# Altium schematic sheet STM32G0B1CEU6.SchDoc
size A3; Revision: 10
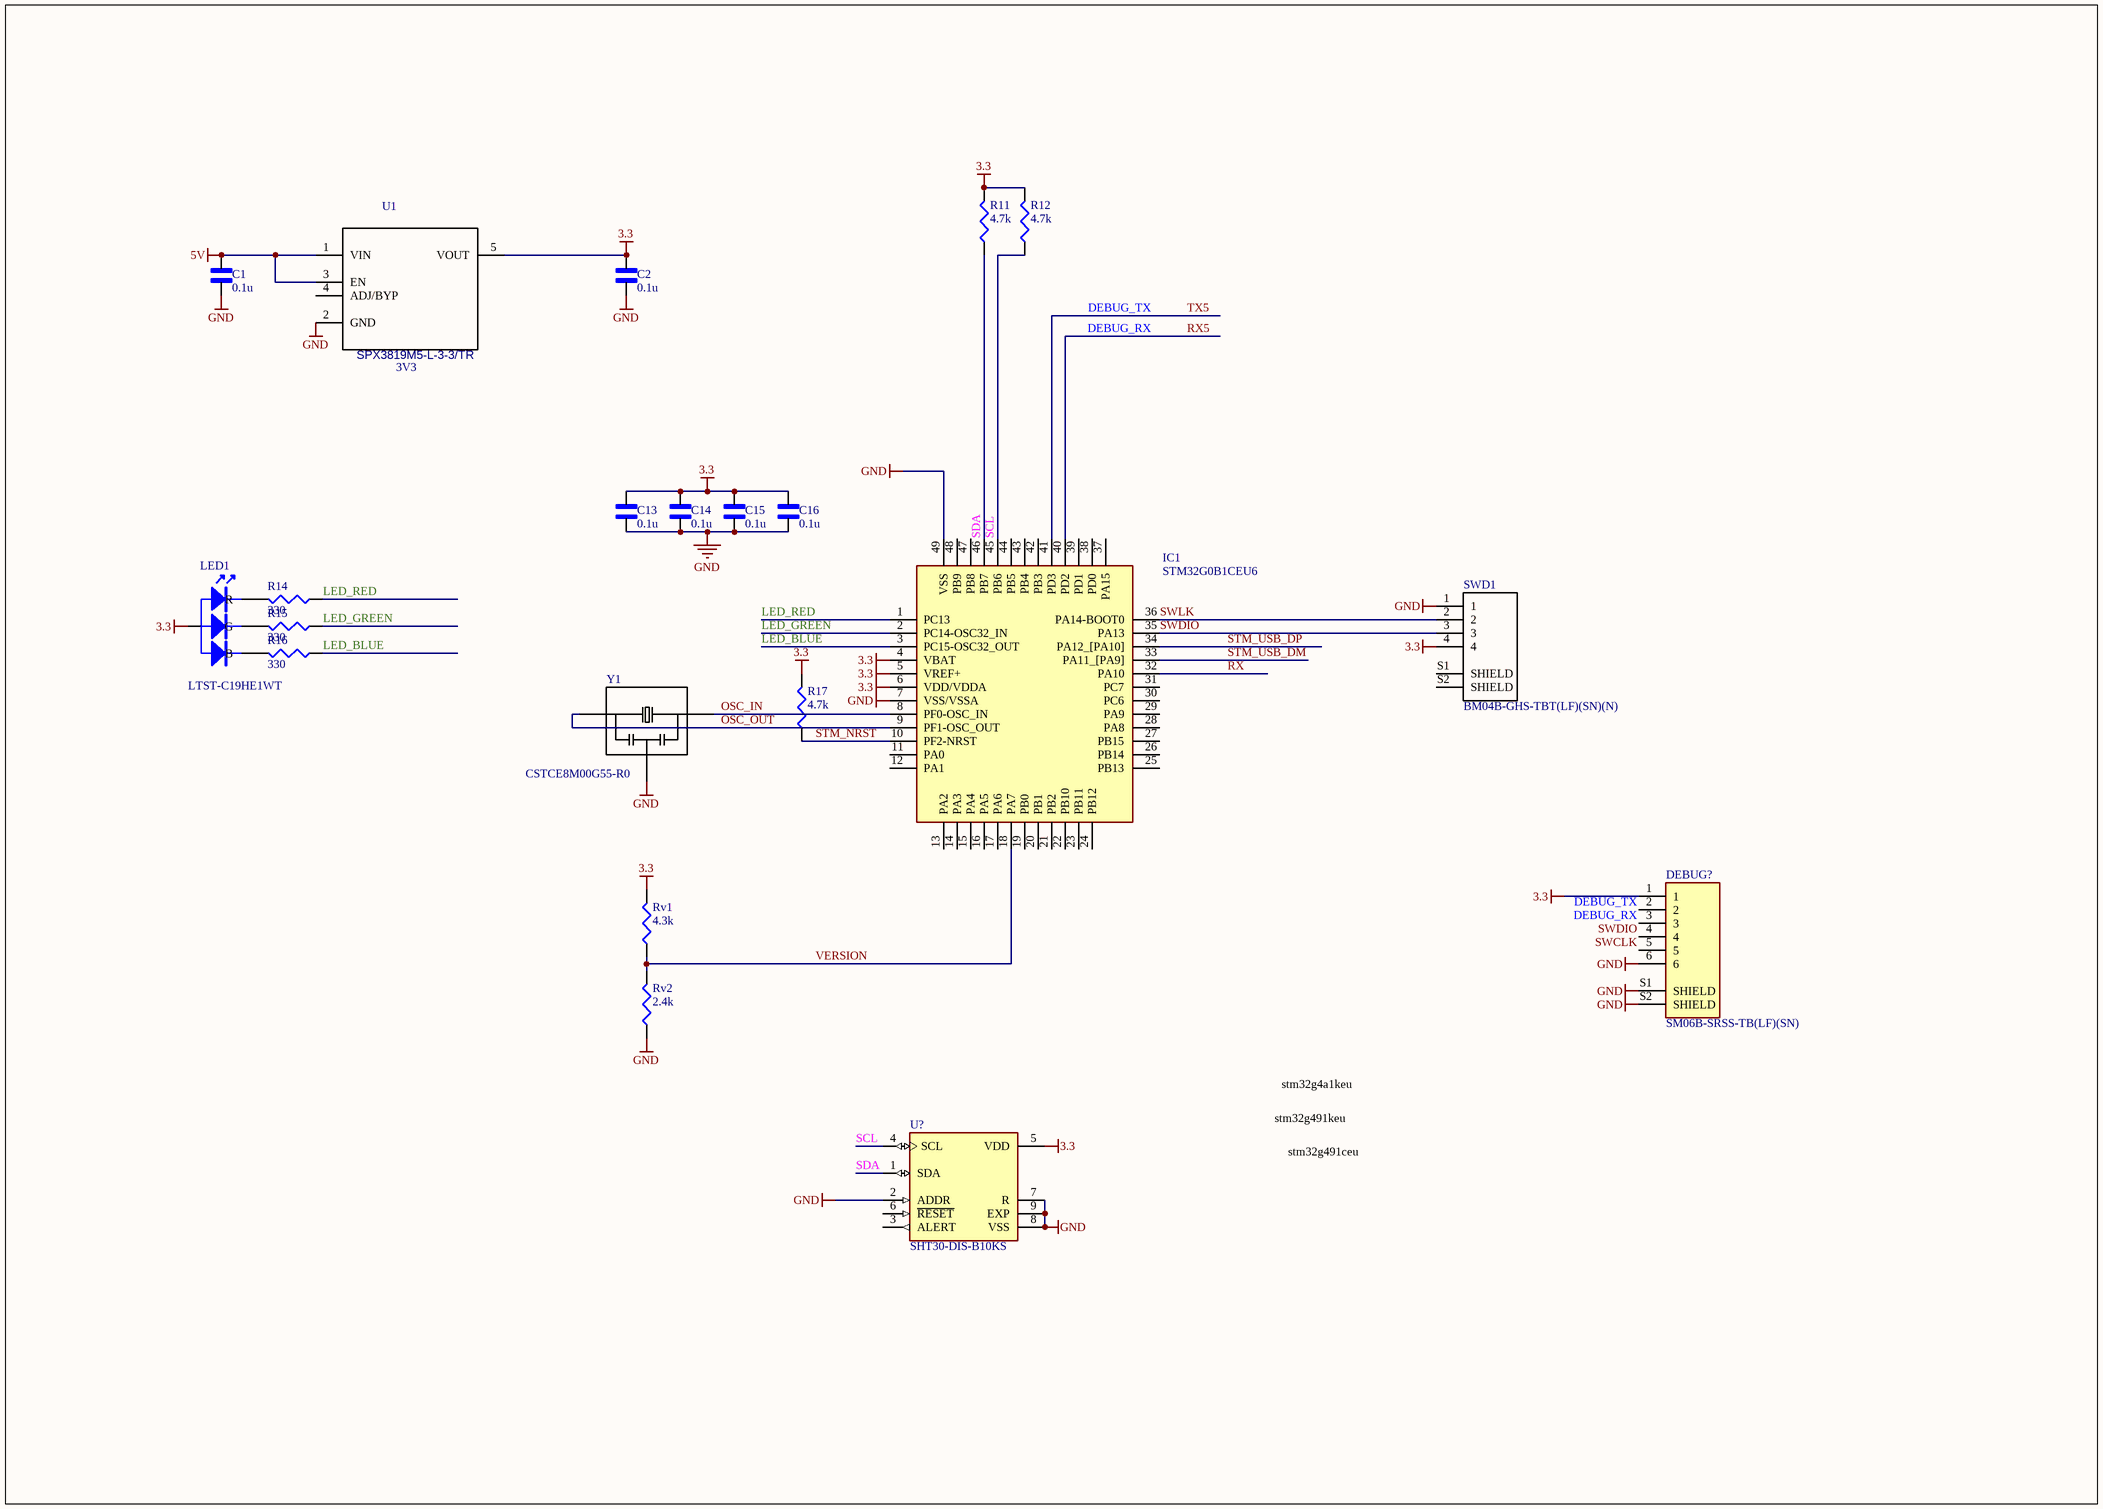
[diagram p0: STM32G0B1CEU6.SchDoc]

## Parts
C1  value 0.1u  [CAPC1005X55N]  (hidden comment: GCM155R71H104KE02D)
C2  value 0.1u  [CAPC1005X55N]  (hidden comment: GCM155R71H104KE02D)
C13  value 0.1u  [CAPC1005X55N]  (hidden comment: GCM155R71H104KE02D)
C14  value 0.1u  [CAPC1005X55N]  (hidden comment: GCM155R71H104KE02D)
C15  value 0.1u  [CAPC1005X55N]  (hidden comment: GCM155R71H104KE02D)
C16  value 0.1u  [CAPC1005X55N]  (hidden comment: GCM155R71H104KE02D)
DEBUG?  SM06B-SRSS-TB(LF)(SN)  [JST_SM06B-SRSS-TB(LF)(SN)]
IC1  STM32G0B1CEU6  [QFN50P700X700X60-49N-D]
LED1  LTST-C19HE1WT  [LTST-C19HE1WT]
R11  value 4.7k  [RESC1005X40N]  (hidden comment: RC0402FR-074K7L)
R12  value 4.7k  [RESC1005X40N]  (hidden comment: RC0402FR-074K7L)
R14  value 330  [RESC1005X40N]  (hidden comment: RC0402FR-07330RL)
R15  value 330  [RESC1005X40N]  (hidden comment: RC0402FR-07330RL)
R16  value 330  [RESC1005X40N]  (hidden comment: RC0402FR-07330RL)
R17  value 4.7k  [RESC1005X40N]  (hidden comment: RC0402FR-074K7L)
Rv1  value 4.3k  [RESC1005X40N]  (hidden comment: RC0402FR-074K3L)
Rv2  value 2.4k  [RESC1005X40N]  (hidden comment: RC0402FR-072K4L)
SWD1  BM04B-GHS-TBT(LF)(SN)(N)  [JST_BM04B-GHS-holes]
U1  value 3V3  [*SOT95P280X145-5N]  (hidden comment: SPX3819M5-L-3-3/TR)
U?  SHT30-DIS-B10KS  [XDCR_SHT30-DIS-B10KS]
Y1  CSTCE8M00G55-R0  [*OSC_CSTCE8M00G55-R0]

## Nets
3.3: C2.2 C13.2 C14.2 C15.2 C16.2 DEBUG?.1 IC1.4(VBAT) IC1.5(VREF+) IC1.6(VDD/VDDA) LED1.4(A) R11.2 R12.2 R17.2 Rv1.2 SWD1.4 U1.5(VOUT) U?.5(VDD)
5V: C1.2 U1.1(VIN) U1.3(EN)
GND: C1.1 C2.1 C13.1 C14.1 C15.1 C16.1 DEBUG?.6 DEBUG?.S1(SHIELD) DEBUG?.S2(SHIELD) IC1.7(VSS/VSSA) IC1.49(VSS) Rv2.1 SWD1.1 U1.2(GND) U?.2(ADDR) U?.7(R) U?.8(VSS) U?.9(EXP) Y1.2
DEBUG_RX: DEBUG?.3 IC1.40(PD2)  [also labelled RX5]
DEBUG_TX: DEBUG?.2 IC1.41(PD3)  [also labelled TX5]
LED_BLUE: IC1.3(PC15-OSC32_OUT) R16.1
LED_GREEN: IC1.2(PC14-OSC32_IN) R15.1
LED_RED: IC1.1(PC13) R14.1
OSC_IN: IC1.8(PF0-OSC_IN) Y1.3
OSC_OUT: IC1.9(PF1-OSC_OUT) Y1.1
RX: IC1.32(PA10)
SCL: IC1.45(PB6) R12.1 U?.4(SCL)
SDA: IC1.46(PB7) R11.1 U?.1(SDA)
STM_NRST: IC1.10(PF2-NRST) R17.1
STM_USB_DM: IC1.33(PA11_[PA9])
STM_USB_DP: IC1.34(PA12_[PA10])
SWCLK: DEBUG?.5
SWDIO: DEBUG?.4 IC1.35(PA13) SWD1.3
SWLK: IC1.36(PA14-BOOT0) SWD1.2
VERSION: IC1.18(PA7) Rv1.1 Rv2.2
NetLED1_1: LED1.1(R) R14.2
NetLED1_2: LED1.2(G) R15.2
NetLED1_3: LED1.3(B) R16.2

Not connected (* = marked no-connect by the designer): IC1 11(PA0) 12(PA1) 13(PA2) 14(PA3) 15(PA4) 16(PA5) 17(PA6) 19(PB0) 20(PB1) 21(PB2) 22(PB10) 23(PB11) 24(PB12) 25(PB13) 26(PB14) 27(PB15) 28(PA8) 29(PA9) 30(PC6) 31(PC7) 37(PA15) 38(PD0) 39(PD1) 42(PB3) 43(PB4) 44(PB5) 47(PB8) 48(PB9); SWD1 S1(SHIELD) S2(SHIELD); U1 4(ADJ/BYP); U? 3(ALERT) 6(~{RESET})

## Notes on the sheet
- stm32g491keu
- stm32g4a1keu
- stm32g491ceu

## Library data of the parts
C1 C2 C13-C16 = GCM155R71H104KE02D: GCM155R71H104KE02D, Чип 0402 X7R 0.1uF +10% 50V,Конденсатор; MF: Murata; Type: SMD; SnapEDA_Link: https://www.snapeda.com/parts/GCM155R71H104KE02D/Murata%20Electronics%20North%20America/view-part/597463/?ref=snap; Package: 0402; MP: GCM155R71H104KE02D; ChipDip_Link: https://www.chipdip.ru/product/gcm155r71h104ke02d-murata
DEBUG? = SM06B-SRSS-TB(LF)(SN): Connector Header Surface Mount, Right Angle 6 position 0.039 _1.00mm_; MP: SM06B-SRSS-TB_LF__SN_; MF: JST Sales; Package: None; Value: *; SnapEDA_Link: https://www.snapeda.com/parts/SM06B-SRSS-TB%28LF%29%28SN%29/JST%20Sales%20America%20Inc./view-part/554386/?ref=snap; Digi-Key_Purchase_URL: https://www.digikey.com/product-detail/en/jst-sales-america-inc/SM06B-SRSS-TB_LF__SN_/455-1806-1-ND/926877?utm_source=snapeda&utm_medium=aggregator&utm_campaign=symbol; Digi-Key_Part_Number: 455-1806-1-ND; System: Connector
IC1 = STM32G0B1CxU6: Integrated Circuit; MF: STMicroelectronics; MP: STM32G0B1CEU6; Type: SMD
LED1 = RGB_LED_5MM: Blue/Green/Red; Type: SMD; ChipDip_Link: https://www.chipdip.ru/product1/8003387462; HelpURL: https://static.chipdip.ru/lib/039/DOC013039662.pdf; MP: LTST-C19HE1WT
R11 R12 = RC0402FR-074K7L: 0.062Вт 0402 4.7 кОм, 1%, Чип резистор (SMD); Pacage Metric: 1005; MF: Yageo or NXP; ChipDip_Link: https://www.chipdip.ru/product0/9000189640; HelpURL: https://www.chipdip.ru/product0/9000189640; Package: RC0402; Type: SMD; MP: RC0402FR-074K7L; SnapEDA_Link: https://www.snapeda.com/parts/CRGCQ0402F10K/TE%20Connectivity/view-part/3186991/?ref=search&t=0402%2010k
R14-R16 = RC0402FR-07330RL: 0.062Вт 0402 330 Ом, 1%, Чип резистор (SMD); Pacage Metric: 1005; MF: Yageo or NXP; ChipDip_Link: https://www.chipdip.ru/product0/9000189640; HelpURL: https://www.chipdip.ru/product0/9000189640; Package: RC0402; Type: SMD; MP: RC0402FR-07330RL; SnapEDA_Link: https://www.snapeda.com/parts/CRGCQ0402F10K/TE%20Connectivity/view-part/3186991/?ref=search&t=0402%2010k
R17 = RC0402FR-074K7L: 0.062Вт 0402 4.7 кОм, 1%, Чип резистор (SMD); MF: Yageo or NXP; ChipDip_Link: https://www.chipdip.ru/product0/9000189640; HelpURL: https://www.chipdip.ru/product0/9000189640; Package: RC0402; Type: SMD; MP: RC0402FR-074K7L; SnapEDA_Link: https://www.snapeda.com/parts/CRGCQ0402F10K/TE%20Connectivity/view-part/3186991/?ref=search&t=0402%2010k
Rv1 = RC0402FR-074K3L_1: 0.062Вт 0402 4.3 кОм, 1%, Чип резистор (SMD); MF: Yageo or NXP; ChipDip_Link: https://www.chipdip.ru/product0/9000189640; HelpURL: https://www.chipdip.ru/product0/9000189640; Package: RC0402; Type: SMD; MP: RC0402FR-074K3L; SnapEDA_Link: https://www.snapeda.com/parts/CRGCQ0402F10K/TE%20Connectivity/view-part/3186991/?ref=search&t=0402%2010k
Rv2 = RC0402FR-072K4L: 0.062Вт 0402 2.4 кОм, 1%, Чип резистор (SMD); MF: Yageo or NXP; ChipDip_Link: https://www.chipdip.ru/product0/9000189640; HelpURL: https://www.chipdip.ru/product0/9000189640; Package: RC0402; Type: SMD; MP: RC0402FR-072K4L; SnapEDA_Link: https://www.snapeda.com/parts/CRGCQ0402F10K/TE%20Connectivity/view-part/3186991/?ref=search&t=0402%2010k
SWD1 = BM04B-GHS-TBT(LF)(SN)(N): Conn Shrouded Header HDR 4 POS 1.25mm Solder ST SMD Reel; MF: JST Sales; MP: SM04B-GHS-TB(LF)(SN); Instructions: DNP; System: Connector; SnapEDA_Link: https://www.snapeda.com/parts/BM04B-GHS-TBT%28LF%29%28SN%29%28N%29/JST%20Sales%20America%20Inc./view-part/?ref=snap; Package: None; Value: *; Type: SMD
U1 = SPX3819M5-L-3-3/TR: Low Dropout Voltage Regulator, 3.3V 0.5A, В±1%, 2.5 to 16 Vin, 5-Pin SOT-23; MF: MaxLinear, Inc.; Package: SOT-23-5 Exar; SnapEDA_Link: https://www.snapeda.com/parts/SPX3819M5-L/MaxLinear%2C%20Inc./view-part/?ref=snap; Type: SMD; ChipDip_Link: https://www.chipdip.ru/product/spx3819m5-l-3-3-tr; HelpURL: http://www.farnell.com/datasheets/2614478.pdf; MP: SPX3819M5-L-3-3/TR
U? = SHT30-DIS-B10KS: SENSOR HUMID/TEMP 5V I2C 2% SMD; Package: None; Price: None; Value: *; MP: SHT30-DIS-B10KS; Availability: Unavailable; HelpURL: https://www.mouser.com/datasheet/2/682/Sensirion_Humidity_Sensors_SHT3x_Datasheet_digital-971521.pdf
Y1 = CSTCE8M00G55-R0: Ceramic Resonator 8MHz ??0.5% _Tol_ ??0.2% _Stability_ 33pF 40Ohm 3-Pin CSMD T/R; MP: CSTCE8M00G55-R0 or CSTCE8M00G52-R0; MF: Murata; Package: SMD-3 Murata; SnapEDA_Link: https://www.snapeda.com/parts/CSTCE8M00G55-R0/Murata%20Electronics%20North%20America/view-part/?ref=snap; Value: 8MHz; ChipDip_Link: https://www.chipdip.ru/product1/8001783721; HelpURL: https://www.murata.com/en-eu/api/pdfdownloadapi?cate=&partno=CSTCE8M00G55-R0; Type: SMD